# Altium schematic sheet Sender_CH2.SchDoc
size A4
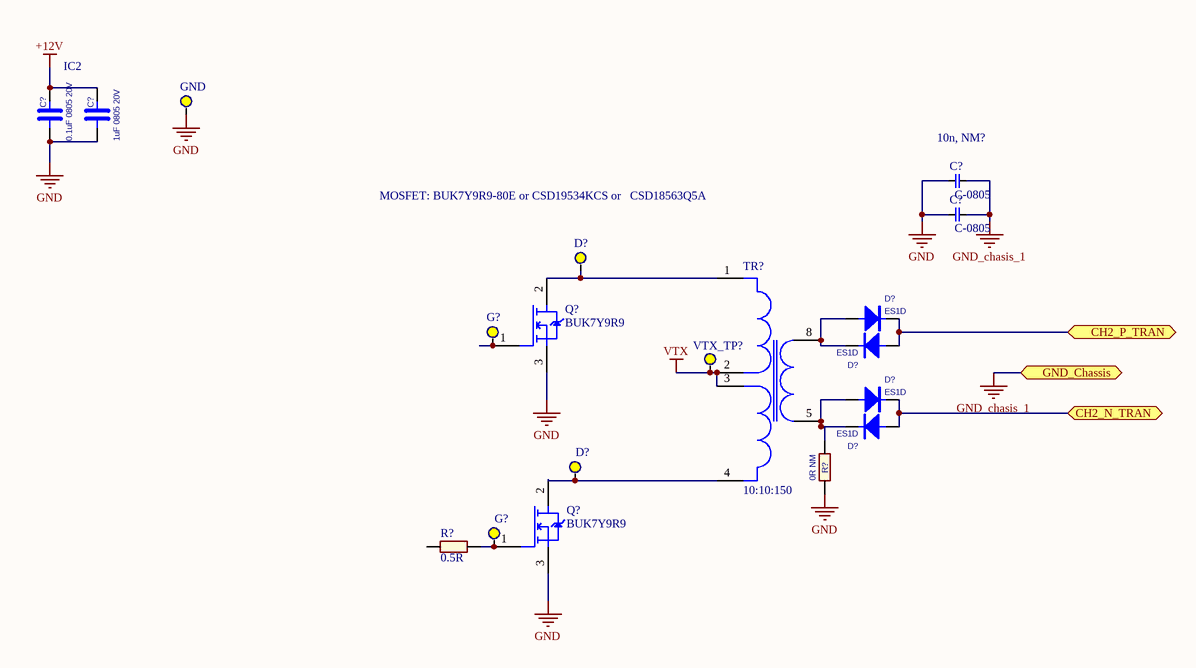
[diagram p0: Sender_CH2.SchDoc]

## Parts
(Parts that share a designator on the sheet are numbered #1, #2 ... from top to bottom, then left to right.)
C?#1  0.1uF 0805 20V  [C-0603]
C?#2  1uF 0805 20V  [C-0603]
C?#3  C-0805  [C-0805]
C?#4  C-0805  [C-0805]
D?#1  Test_Point  [Test_Point]  (value not drawn)
D?#2  ES1D  [SMA]
D?#3  ES1D  [SMA]
D?#4  ES1D  [SMA]
D?#5  ES1D  [SMA]
D?#6  Test_Point  [Test_Point]  (value not drawn)
G?#1  Test_Point  [Test_Point]  (value not drawn)
G?#2  Test_Point  [Test_Point]  (value not drawn)
Q?#1  BUK7Y9R9  [BUK7Y9R)]
Q?#2  BUK7Y9R9  [BUK7Y9R)]
R?#1  0R NM  [RES-0805]
R?#2  0.5R  [R-0603]
TP?  GND  [Test_Point]
TR?  10:10:150  [Trafo_15x15]
VTX_TP?  Test_Point  [Test_Point]  (value not drawn)

## Ports
CH2_N_TRAN (bidir), CH2_P_TRAN (bidir), GND_Chassis (bidir)

## Nets
+12V: C?#1.2 C?#2.2
GND: C?#1.1 C?#2.1 C?#3.1(G) C?#4.1(G) Q?#1.3(G) Q?#2.3(G) R?#1.1 TP?.1
GND_chasis_1: C?#3.2(G) C?#4.2(G) ; port GND_Chassis
VTX: TR?.2(G) TR?.3(G) VTX_TP?.1
CH2_N_TRAN: D?#4.2(C) D?#5.1(A) ; port CH2_N_TRAN
CH2_P_TRAN: D?#2.2(C) D?#3.1(A) ; port CH2_P_TRAN
NetD?#1_1: D?#1.1 Q?#1.2(G) TR?.1(G)
NetD?#2_1: D?#2.1(A) D?#3.2(C) TR?.8(G)
NetD?#4_1: D?#4.1(A) D?#5.2(C) R?#1.2 TR?.5(G)
NetD?#6_1: D?#6.1 Q?#2.2(G) TR?.4(G)
NetG?#1_1: G?#1.1 Q?#1.1(G)
NetG?#2_1: G?#2.1 Q?#2.1(G) R?#2.2

Not connected (* = marked no-connect by the designer): R?#2 1

## Notes on the sheet
- (near C?#1) IC2
- (near C?#3) 10n, NM?
- MOSFET: BUK7Y9R9-80E or CSD19534KCS or   CSD18563Q5A

## Library data of the parts
C?#1 C?#2 = 0805CAPxxrrrrv: CAP CER rrrrUF xV x% type 0805
C?#3 C?#4 = C-0805: Manufacturer 1: Yageo; Manufacturer Part Number 1: CC1206KKX7RBBB332; Tolerance: ±10%; Voltage - Rated: 500V; Temperature Coefficient: X7R; Notification: Current market demand for these product types have resulted in fluctuating and extending lead times. Lead times may differ.; Description 1: CAP CER 3300PF 500V X7R 1206; Category 1: Capacitors; Packaging: Cut Tape (CT); Part Status: Active; Operating Temperature: -55°C ~ 125°C; Features: -; Ratings: -; Applications: General Purpose; Failure Rate: -; Mounting Type: Surface Mount, MLCC; Package / Case: 1206 (3216 Metric); Size / Dimension: 0.126" L x 0.063" W (3.20mm x 1.60mm); Height - Seated (Max): -; Thickness (Max): 0.057" (1.45mm); Lead Spacing: -; Lead Style: -; ComponentLink1URL: http://www.yageo.com/documents/recent/UPY-NP0X7R_MV_100-to-630V_21.pdf; ComponentLink1Description: http://www.yageo.com/documents/recent/UPY-NP0X7R_MV_100-to-630V_21.pdf; Supplier 1: Digi-Key; Supplier Part Number 1: 311-1506-1-ND; RoHS 1: RoHS Compliant; Stock 1: 4928; Pricing 1: 1=0.31, 10=0.214, 100=0.1085, 500=0.07424, 1000=0.06568 (USD)
D?#2-D?#5 = ES1x: Diode; Manufacturer: Fairchild/ON Semiconductor; Diode Type: Standard; Voltage - DC Reverse (Vr) (Max): 200V; Current - Average Rectified (Io): 1A; Voltage - Forward (Vf) (Max) @ If: 920mV @ 1A; Speed: Fast Recovery =< 500ns, > 200mA (Io); Reverse Recovery Time (trr): 15ns; Current - Reverse Leakage @ Vr: 5μA @ 200V; Capacitance @ Vr, F: 7pF @ 4V, 1MHz; Supplier 1: Digi-Key; Supplier Part Number 1: ES1DFSTR-ND; Manufacturer Part Number: ES1D; RoHS: RoHS Compliant; Category: Discrete Semiconductor Products; Stock 1: 135000; Pricing 1: 7500=0.0567, 15000=0.0504, 37500=0.04725, 52500=0.0419, 187500=0.04032 (USD); Packaging: Tape & Reel (TR); Part Status: Active; Mounting Type: Surface Mount; Package / Case: DO-214AC, SMA; Supplier Device Package: SMA (DO-214AC); Operating Temperature - Junction: -55°C ~ 150°C; ComponentLink1URL: https://www.fairchildsemi.com/datasheets/ES/ES1A.pdf; ComponentLink1Description: https://www.fairchildsemi.com/datasheets/ES/ES1A.pdf
R?#1 = CRCW0805xxxxJN Default: RES xx OHM 1/8W 5% 0805 SMD; Category 1: Resistors
R?#2 = RES-0805
TP? = Test_Point
TR? = TRAFO_15x15: Coil Forme: B66414B6008T001; Yoke: B66414B2000X000; Cover Plate: B66414A7000X000; link PDF: https://www.tdk-electronics.tdk.com/inf/80/db/fer/efd_15_8_5.pdf